# Altium schematic sheet Power.SchDoc
size A4; PageSetup: Record=PageOptions|CenterHorizontal=True|CenterVertical=True|PrintScale=0.96|XCorrection=1.00|YCorrection=1.00|PrintKind=2|BorderSize=5000000|LeftOffset=0|BottomOffset=0|Orientation=2|PaperLength=1000|PaperWidth=1000|Scale=100|PaperSource=7|PrintQuality=-4|MediaType=1|DitherType=10|PaperKind=A4|PrintScaleMode=1
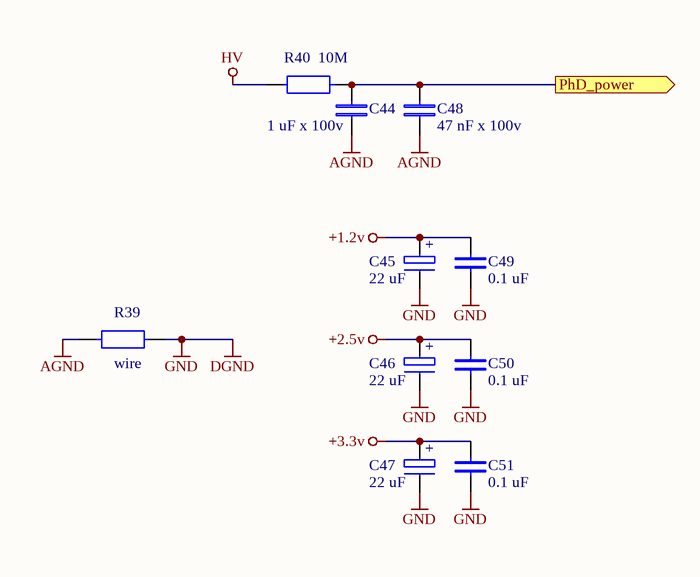
[diagram p0: Power.SchDoc]

## Parts
C44  1 uF x 100v  [CAP4]
C45  22 uF  [CP6032]
C46  22 uF  [CP6032]
C47  22 uF  [CP6032]
C48  47 nF x 100v  [1206]
C49  0.1 uF  [1206]
C50  0.1 uF  [1206]
C51  0.1 uF  [1206]
R39  wire  [1206]
R40  10M  [1206]

## Ports
PhD_power (out)

## Nets
+1.2v: C45.+ C49.2
+2.5v: C46.+ C50.2
+3.3v: C47.+ C51.2
AGND: C44.1 C48.1 R39.2
DGND: C45.- C46.- C47.- C49.1 C50.1 C51.1 R39.1  [also labelled GND]
HV: R40.1
PhD_power: C44.2 C48.2 R40.2 ; port PhD_power

## Library data of the parts
C44 = C: K73-17
C45-C47 = C POL
C48-C51 = C
R39 R40 = R